# Altium project UZ_A_DSUB_Breakout.PrjPCB
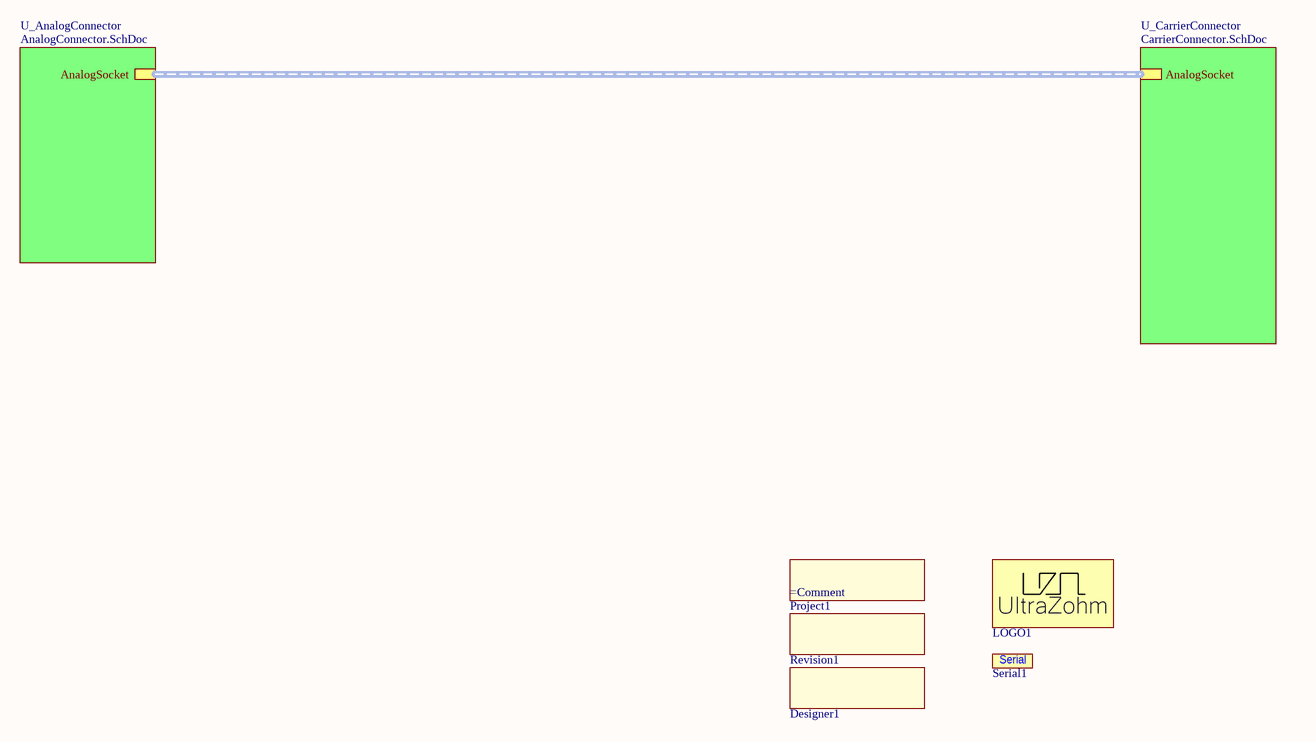
[diagram p0: TopSheet.SchDoc]
ProjectNameCustom: =ProjectName; ProjectRevision: Rev01; ProjectName: UZ_A_DSUB_Breakout; Date: 12/2022; AuthorParam: Andreas Geiger; Author: Andreas Geiger
3 sheets, 7 parts. Net scope: hierarchical (ports join the sheet entries above them; power ports are global).
Board file: UZ_A_DSUB_Breakout.PcbDoc
Sheets:
  TopSheet.SchDoc
    U_CarrierConnector = CarrierConnector.SchDoc
    U_AnalogConnector = AnalogConnector.SchDoc

## Sheet TopSheet.SchDoc
size A4; Author: Andreas Geiger; CompanyName: Technische Hochschule Nürnberg Georg Simon Ohm; Organization: UltraZohm; Address1: Kesslerplatz 12; Address2: 90489 Nürnberg; Address3: GERMANY; DocumentNumber: 1; SheetNumber: 1; SheetTotal: 3; Website: www.ultrazohm.com

### Parts
Designer1  (no value)  [Designator:comment]  (no BOM)
LOGO1  UZ Logo  [UZ_Logo_medium]  (value not drawn)  (no BOM)
Project1  (no value)  [COMMENT]  (no BOM)
Revision1  (no value)  [Designator:comment]  (no BOM)
Serial1  Serial #  [SERIAL]  (value not drawn)  (no BOM)

### Sub-sheets
U_AnalogConnector = AnalogConnector.SchDoc: AnalogSocket (harness AnalogSocket)
U_CarrierConnector = CarrierConnector.SchDoc: AnalogSocket (harness AnalogSocket)

### Buses and harness runs
harness sheet U_AnalogConnector/AnalogSocket = sheet U_CarrierConnector/AnalogSocket

### Notes on the sheet
- Title
- Revision:
- Design Engineer:
- Date:
- Project:
- Sheet
- of
- (in symbol 6) Serial

### Library data of the parts
Designer1 = 4: Create a project parameter named "Author" this is the value of this component. It is printed on the PCB. Once the parameter is updated (e.g. new revision) it gets updated on the PCB as well; Manufacturer: PCB Manufacturer; Manufacturer Part Number: Project Author; Value: Andreas Geiger; Created from: T. Wendt; PartID: 4; Created On: 01.03.2021 08:53:41; Component Type: Project Author; Last Updated: 01.03.2021 09:20:27; Type: Standard (No BOM); Live Cycle Status: 1
LOGO1 = 1: Official Project Logo of the UltraZohm; Manufacturer: PCB Manufacturer; Manufacturer Part Number: UltraZohm Logo; Created from: T. Wendt; PartID: 1; Created On: 19.02.2021 16:55:56; ComponentLink1Description: Homepage; ComponentLink1URL: https://ultrazohm.com; Component Type: Logo; Last Updated: 02.03.2021 14:31:24; Type: Standard (No BOM); Live Cycle Status: 1
Project1 = 2: Create a project parameter named "ProjectNameCustom" this is the value of this component and it is printed on the PCB.; Manufacturer: PCB Manufacturer; Created from: T. Wendt; PartID: 2; Created On: 01.03.2021 08:43:57; Component Type: Project Name; Last Updated: 01.03.2021 09:07:27; Manufacturer Part Number: Project Name; Type: Standard (No BOM); Value: =ProjectName; Live Cycle Status: 1
Revision1 = 3: Create a project parameter named "ProjectRevision" this is the value of this component. It is printed on the PCB. Once the parameter is updated (e.g. new revision) it gets updated on the PCB as well; Manufacturer: PCB Manufacturer; Value: Rev01; Created from: T. Wendt; PartID: 3; Created On: 01.03.2021 08:50:34; Component Type: Project Revision; Last Updated: 01.03.2021 09:28:36; Manufacturer Part Number: Project Revision; Type: Standard (No BOM); Live Cycle Status: 1
Serial1 = 6: Field to put in a serial number; Manufacturer: PCB Manufacturer; Created from: T. Wendt; PartID: 6; Created On: 02.03.2021 14:31:24; Component Type: Serial Number; Last Updated: 02.03.2021 14:31:24; Manufacturer Part Number: Serial Number; Type: Standard (No BOM); Live Cycle Status: 1

## Sheet CarrierConnector.SchDoc
size A4; Author: Andreas Geiger; CompanyName: Technische Hochschule Nürnberg Georg Simon Ohm; Organization: UltraZohm; Address1: Kesslerplatz 12; Address2: 90489 Nürnberg; Address3: GERMANY; DocumentNumber: 2; SheetNumber: 2; SheetTotal: 3; Website: www.ultrazohm.com
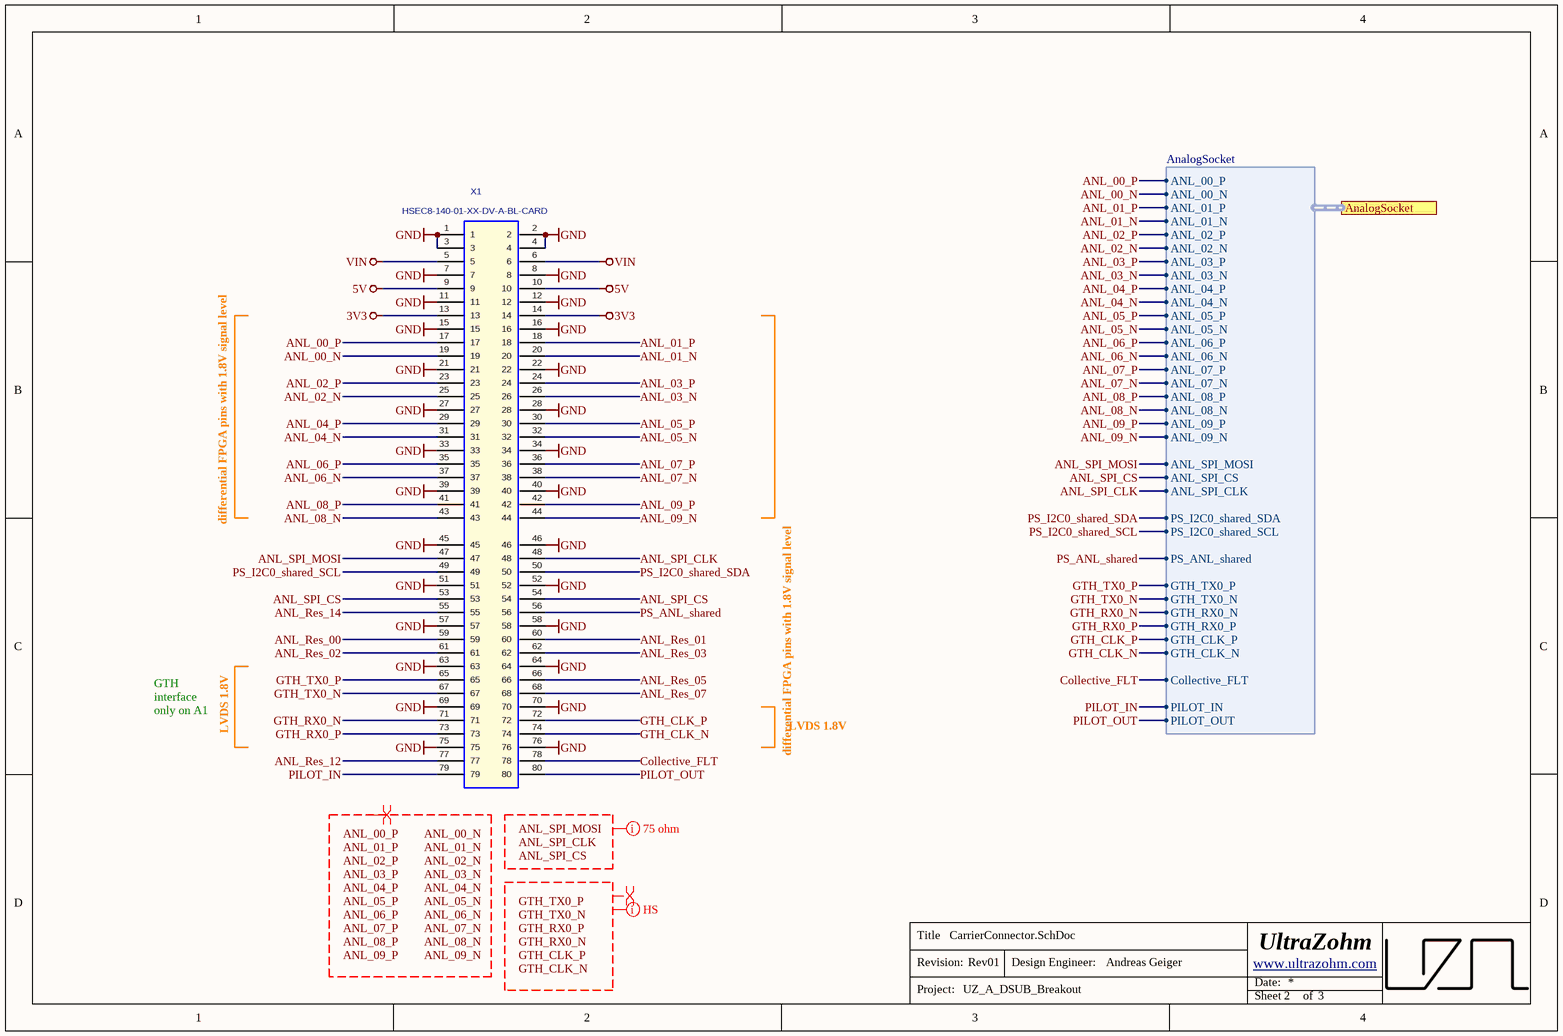
[diagram p1: CarrierConnector.SchDoc]

### Parts
X1  HSEC8-140-01-XX-DV-A-BL-CARD  [HSEC8-140-01-XX-DV-A-BL-CARD]  (no BOM)

### Ports
AnalogSocket (harness AnalogSocket)

### Harnesses
AnalogSocket: ANL_01_P, ANL_01_N, ANL_03_P, ANL_03_N, ANL_05_P, ANL_05_N, ANL_07_P, ANL_07_N, ANL_00_P, ANL_00_N, ANL_02_P, ANL_02_N, ANL_04_P, ANL_04_N, ANL_06_P, ANL_06_N, ANL_08_P, ANL_08_N, ANL_09_P, ANL_09_N, ANL_SPI_MOSI, ANL_SPI_CS, ANL_SPI_CLK, PS_I2C0_shared_SDA, PS_I2C0_shared_SCL, PS_ANL_shared, GTH_TX0_P, GTH_TX0_N, GTH_RX0_N, GTH_RX0_P, GTH_CLK_P, GTH_CLK_N, Collective_FLT, PILOT_IN, PILOT_OUT

### Nets
3V3: X1.13 X1.14
5V: X1.9 X1.10
GND: X1.1 X1.2 X1.3 X1.4 X1.7 X1.8 X1.11 X1.12 X1.15 X1.16 X1.21 X1.22 X1.27 X1.28 X1.33 X1.34 X1.39 X1.40 X1.45 X1.46 X1.51 X1.52 X1.57 X1.58 X1.63 X1.64 X1.69 X1.70 X1.75 X1.76
VIN: X1.5 X1.6
ANL_00_N: X1.19 ; port AnalogSocket.ANL_00_N
ANL_00_P: X1.17 ; port AnalogSocket.ANL_00_P
ANL_01_N: X1.20 ; port AnalogSocket.ANL_01_N
ANL_01_P: X1.18 ; port AnalogSocket.ANL_01_P
ANL_02_N: X1.25 ; port AnalogSocket.ANL_02_N
ANL_02_P: X1.23 ; port AnalogSocket.ANL_02_P
ANL_03_N: X1.26 ; port AnalogSocket.ANL_03_N
ANL_03_P: X1.24 ; port AnalogSocket.ANL_03_P
ANL_04_N: X1.31 ; port AnalogSocket.ANL_04_N
ANL_04_P: X1.29 ; port AnalogSocket.ANL_04_P
ANL_05_N: X1.32 ; port AnalogSocket.ANL_05_N
ANL_05_P: X1.30 ; port AnalogSocket.ANL_05_P
ANL_06_N: X1.37 ; port AnalogSocket.ANL_06_N
ANL_06_P: X1.35 ; port AnalogSocket.ANL_06_P
ANL_07_N: X1.38 ; port AnalogSocket.ANL_07_N
ANL_07_P: X1.36 ; port AnalogSocket.ANL_07_P
ANL_08_N: X1.43 ; port AnalogSocket.ANL_08_N
ANL_08_P: X1.41 ; port AnalogSocket.ANL_08_P
ANL_09_N: X1.44 ; port AnalogSocket.ANL_09_N
ANL_09_P: X1.42 ; port AnalogSocket.ANL_09_P
ANL_Res_00: X1.59
ANL_Res_01: X1.60
ANL_Res_02: X1.61
ANL_Res_03: X1.62
ANL_Res_05: X1.66
ANL_Res_07: X1.68
ANL_Res_12: X1.77
ANL_Res_14: X1.55
ANL_SPI_CLK: X1.48 ; port AnalogSocket.ANL_SPI_CLK
ANL_SPI_CS: X1.53 X1.54 ; port AnalogSocket.ANL_SPI_CS
ANL_SPI_MOSI: X1.47 ; port AnalogSocket.ANL_SPI_MOSI
Collective_FLT: X1.78 ; port AnalogSocket.Collective_FLT
GTH_CLK_N: X1.74 ; port AnalogSocket.GTH_CLK_N
GTH_CLK_P: X1.72 ; port AnalogSocket.GTH_CLK_P
GTH_RX0_N: X1.71 ; port AnalogSocket.GTH_RX0_N
GTH_RX0_P: X1.73 ; port AnalogSocket.GTH_RX0_P
GTH_TX0_N: X1.67 ; port AnalogSocket.GTH_TX0_N
GTH_TX0_P: X1.65 ; port AnalogSocket.GTH_TX0_P
PILOT_IN: X1.79 ; port AnalogSocket.PILOT_IN
PILOT_OUT: X1.80 ; port AnalogSocket.PILOT_OUT
PS_ANL_shared: X1.56 ; port AnalogSocket.PS_ANL_shared
PS_I2C0_shared_SCL: X1.49 ; port AnalogSocket.PS_I2C0_shared_SCL
PS_I2C0_shared_SDA: X1.50 ; port AnalogSocket.PS_I2C0_shared_SDA

### Layout directives
net class S75: ANL_SPI_CLK, ANL_SPI_CS, ANL_SPI_MOSI
differential pair: ANL_00_N, ANL_00_P, ANL_01_N, ANL_01_P, ANL_02_N, ANL_02_P, ANL_03_N, ANL_03_P, ANL_04_N, ANL_04_P, ANL_05_N, ANL_05_P, ANL_06_N, ANL_06_P, ANL_07_N, ANL_07_P, ANL_08_N, ANL_08_P, ANL_09_N, ANL_09_P, GTH_CLK_N, GTH_CLK_P, GTH_RX0_N, GTH_RX0_P, GTH_TX0_N, GTH_TX0_P
net class HS: GTH_CLK_N, GTH_CLK_P, GTH_RX0_N, GTH_RX0_P, GTH_TX0_N, GTH_TX0_P

### Notes on the sheet
- differential FPGA pins with 1.8V signal level
- GTH interface only on A1
- LVDS 1.8V
- Labels drawn without touching a wire or pin: ANL_00_N, ANL_00_P, ANL_01_N, ANL_01_P, ANL_02_N, ANL_02_P, ANL_03_N, ANL_03_P, ANL_04_N, ANL_04_P, ANL_05_N, ANL_05_P, ANL_06_N, ANL_06_P, ANL_07_N, ANL_07_P, ANL_08_N, ANL_08_P, ANL_09_N, ANL_09_P, ANL_SPI_CLK, ANL_SPI_CS, ANL_SPI_MOSI, GTH_CLK_N, GTH_CLK_P, GTH_RX0_N, GTH_RX0_P, GTH_TX0_N, GTH_TX0_P
- Title
- Revision:
- Design Engineer:
- Date:
- Project:
- Sheet
- of

### Library data of the parts
X1 = HSEC8-140-01-XX-DV-A-BL-CARD: Mating Card Layout for HSEC8-140-01-XX-DV-A-BL-CARD; Manufacturer: SAMTEC; Created from: MHlatky; Number of positions: 100; Created: 2018_04_23_AGeiger; Value: HSEC8-140-01-XX-DV-A-BL-CARD; Manufacturer Part Number: HSEC8-140-01-XX-DV-A-BL-CARD; PartID: 21; Created On: 26.02.2021 16:36:12; ComponentLink1Description: Homepage; ComponentLink1URL: https://www.samtec.com/products/hsec8-dp; Component Type: Board to Board Connector; Device Package: PCB Shape; Last Updated: 26.02.2021 16:37:20; Mounting Type: PCB Shape; Series: HSEC8; Supplier 1: SAMTEC; Supplier Part Number 1: NA; Type: Board to Board Connector; Live Cycle Status: 1; Stock number: not stored; Number of rows: 2

## Sheet AnalogConnector.SchDoc
size A4; Author: Andreas Geiger; CompanyName: Technische Hochschule Nürnberg Georg Simon Ohm; Organization: UltraZohm; Address1: Kesslerplatz 12; Address2: 90489 Nürnberg; Address3: GERMANY; DocumentNumber: 3; SheetNumber: 3; SheetTotal: 3; Website: www.ultrazohm.com
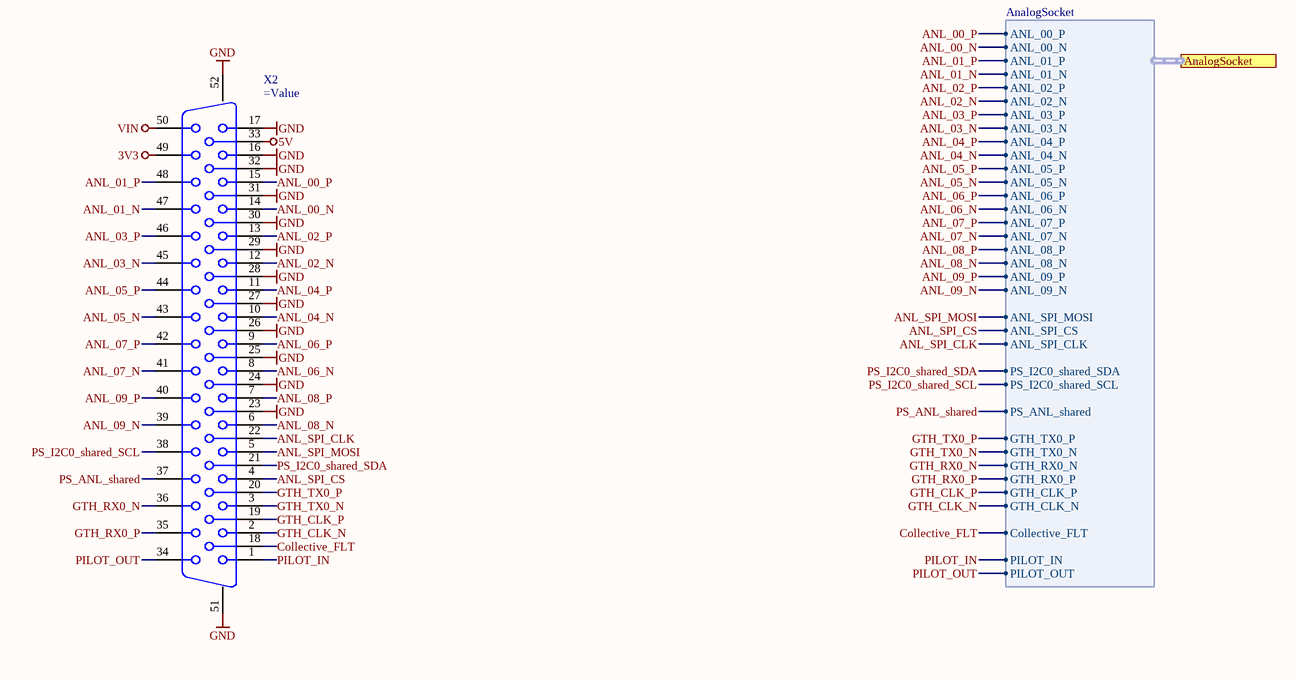
[diagram p2: AnalogConnector.SchDoc]

### Parts
X2  (no value)  [dsub50_male_163A18339X]

### Ports
AnalogSocket (harness AnalogSocket)

### Harnesses
AnalogSocket: ANL_01_P, ANL_01_N, ANL_03_P, ANL_03_N, ANL_05_P, ANL_05_N, ANL_07_P, ANL_07_N, ANL_00_P, ANL_00_N, ANL_02_P, ANL_02_N, ANL_04_P, ANL_04_N, ANL_06_P, ANL_06_N, ANL_08_P, ANL_08_N, ANL_09_P, ANL_09_N, ANL_SPI_MOSI, ANL_SPI_CS, ANL_SPI_CLK, PS_I2C0_shared_SDA, PS_I2C0_shared_SCL, PS_ANL_shared, GTH_TX0_P, GTH_TX0_N, GTH_RX0_N, GTH_RX0_P, GTH_CLK_P, GTH_CLK_N, Collective_FLT, PILOT_IN, PILOT_OUT

### Nets
3V3: X2.49
5V: X2.33
GND: X2.16 X2.17 X2.23 X2.24 X2.25 X2.26 X2.27 X2.28 X2.29 X2.30 X2.31 X2.32 X2.51 X2.52
VIN: X2.50
ANL_00_N: X2.14 ; port AnalogSocket.ANL_00_N
ANL_00_P: X2.15 ; port AnalogSocket.ANL_00_P
ANL_01_N: X2.47 ; port AnalogSocket.ANL_01_N
ANL_01_P: X2.48 ; port AnalogSocket.ANL_01_P
ANL_02_N: X2.12 ; port AnalogSocket.ANL_02_N
ANL_02_P: X2.13 ; port AnalogSocket.ANL_02_P
ANL_03_N: X2.45 ; port AnalogSocket.ANL_03_N
ANL_03_P: X2.46 ; port AnalogSocket.ANL_03_P
ANL_04_N: X2.10 ; port AnalogSocket.ANL_04_N
ANL_04_P: X2.11 ; port AnalogSocket.ANL_04_P
ANL_05_N: X2.43 ; port AnalogSocket.ANL_05_N
ANL_05_P: X2.44 ; port AnalogSocket.ANL_05_P
ANL_06_N: X2.8 ; port AnalogSocket.ANL_06_N
ANL_06_P: X2.9 ; port AnalogSocket.ANL_06_P
ANL_07_N: X2.41 ; port AnalogSocket.ANL_07_N
ANL_07_P: X2.42 ; port AnalogSocket.ANL_07_P
ANL_08_N: X2.6 ; port AnalogSocket.ANL_08_N
ANL_08_P: X2.7 ; port AnalogSocket.ANL_08_P
ANL_09_N: X2.39 ; port AnalogSocket.ANL_09_N
ANL_09_P: X2.40 ; port AnalogSocket.ANL_09_P
ANL_SPI_CLK: X2.22 ; port AnalogSocket.ANL_SPI_CLK
ANL_SPI_CS: X2.4 ; port AnalogSocket.ANL_SPI_CS
ANL_SPI_MOSI: X2.5 ; port AnalogSocket.ANL_SPI_MOSI
Collective_FLT: X2.18 ; port AnalogSocket.Collective_FLT
GTH_CLK_N: X2.2 ; port AnalogSocket.GTH_CLK_N
GTH_CLK_P: X2.19 ; port AnalogSocket.GTH_CLK_P
GTH_RX0_N: X2.36 ; port AnalogSocket.GTH_RX0_N
GTH_RX0_P: X2.35 ; port AnalogSocket.GTH_RX0_P
GTH_TX0_N: X2.3 ; port AnalogSocket.GTH_TX0_N
GTH_TX0_P: X2.20 ; port AnalogSocket.GTH_TX0_P
PILOT_IN: X2.1 ; port AnalogSocket.PILOT_IN
PILOT_OUT: X2.34 ; port AnalogSocket.PILOT_OUT
PS_ANL_shared: X2.37 ; port AnalogSocket.PS_ANL_shared
PS_I2C0_shared_SCL: X2.38 ; port AnalogSocket.PS_I2C0_shared_SCL
PS_I2C0_shared_SDA: X2.21 ; port AnalogSocket.PS_I2C0_shared_SDA

### Notes on the sheet
- Title
- Revision:
- Design Engineer:
- Date:
- Project:
- Sheet
- of

### Library data of the parts
X2 = 163A18339X: D-Sub Standard Connectors DSUB SOLDER PIN ANG 9.4mm; MF: CONEC; Created from: AGeiger; MPN: 163A18339X; Value: 163A18339X; Supplier Part Number 1: D-SUB ST 50GWC; Supplier 1: Reichelt; Supplier 2: Mouser; Supplier 3: Digi-Key; Created: 2021_03_25_AGeiger; Manufacturer Part Number: 163A18339X; PartID: 3; Created On: 22.12.2022 17:03:01; ComponentLink1Description: Datasheet; ComponentLink1URL: https://conec.com/catalog/pub/media/conec/drawings/163A18339X.pdf; Last Updated: 22.12.2022 17:05:07; Manufacturer: CONEC; Mounting Type: THT; Operating Temperature: -55 °C to +125 °C; Series: D-SUB Standard

## Nets that join several sheets
3V3: CarrierConnector (X1.13 X1.14), AnalogConnector (X2.49)
5V: CarrierConnector (X1.9 X1.10), AnalogConnector (X2.33)
GND: CarrierConnector (30 pins), AnalogConnector (14 pins)
VIN: CarrierConnector (X1.5 X1.6), AnalogConnector (X2.50)
ANL_00_N: CarrierConnector (X1.19), AnalogConnector (X2.14)
ANL_00_P: CarrierConnector (X1.17), AnalogConnector (X2.15)
ANL_01_N: CarrierConnector (X1.20), AnalogConnector (X2.47)
ANL_01_P: CarrierConnector (X1.18), AnalogConnector (X2.48)
ANL_02_N: CarrierConnector (X1.25), AnalogConnector (X2.12)
ANL_02_P: CarrierConnector (X1.23), AnalogConnector (X2.13)
ANL_03_N: CarrierConnector (X1.26), AnalogConnector (X2.45)
ANL_03_P: CarrierConnector (X1.24), AnalogConnector (X2.46)
ANL_04_N: CarrierConnector (X1.31), AnalogConnector (X2.10)
ANL_04_P: CarrierConnector (X1.29), AnalogConnector (X2.11)
ANL_05_N: CarrierConnector (X1.32), AnalogConnector (X2.43)
ANL_05_P: CarrierConnector (X1.30), AnalogConnector (X2.44)
ANL_06_N: CarrierConnector (X1.37), AnalogConnector (X2.8)
ANL_06_P: CarrierConnector (X1.35), AnalogConnector (X2.9)
ANL_07_N: CarrierConnector (X1.38), AnalogConnector (X2.41)
ANL_07_P: CarrierConnector (X1.36), AnalogConnector (X2.42)
ANL_08_N: CarrierConnector (X1.43), AnalogConnector (X2.6)
ANL_08_P: CarrierConnector (X1.41), AnalogConnector (X2.7)
ANL_09_N: CarrierConnector (X1.44), AnalogConnector (X2.39)
ANL_09_P: CarrierConnector (X1.42), AnalogConnector (X2.40)
ANL_SPI_CLK: CarrierConnector (X1.48), AnalogConnector (X2.22)
ANL_SPI_CS: CarrierConnector (X1.53 X1.54), AnalogConnector (X2.4)
ANL_SPI_MOSI: CarrierConnector (X1.47), AnalogConnector (X2.5)
Collective_FLT: CarrierConnector (X1.78), AnalogConnector (X2.18)
GTH_CLK_N: CarrierConnector (X1.74), AnalogConnector (X2.2)
GTH_CLK_P: CarrierConnector (X1.72), AnalogConnector (X2.19)
GTH_RX0_N: CarrierConnector (X1.71), AnalogConnector (X2.36)
GTH_RX0_P: CarrierConnector (X1.73), AnalogConnector (X2.35)
GTH_TX0_N: CarrierConnector (X1.67), AnalogConnector (X2.3)
GTH_TX0_P: CarrierConnector (X1.65), AnalogConnector (X2.20)
PILOT_IN: CarrierConnector (X1.79), AnalogConnector (X2.1)
PILOT_OUT: CarrierConnector (X1.80), AnalogConnector (X2.34)
PS_ANL_shared: CarrierConnector (X1.56), AnalogConnector (X2.37)
PS_I2C0_shared_SCL: CarrierConnector (X1.49), AnalogConnector (X2.38)
PS_I2C0_shared_SDA: CarrierConnector (X1.50), AnalogConnector (X2.21)

## Assembly variants
Default: not fitted R? R?